# Altium project quang.PrjPcb
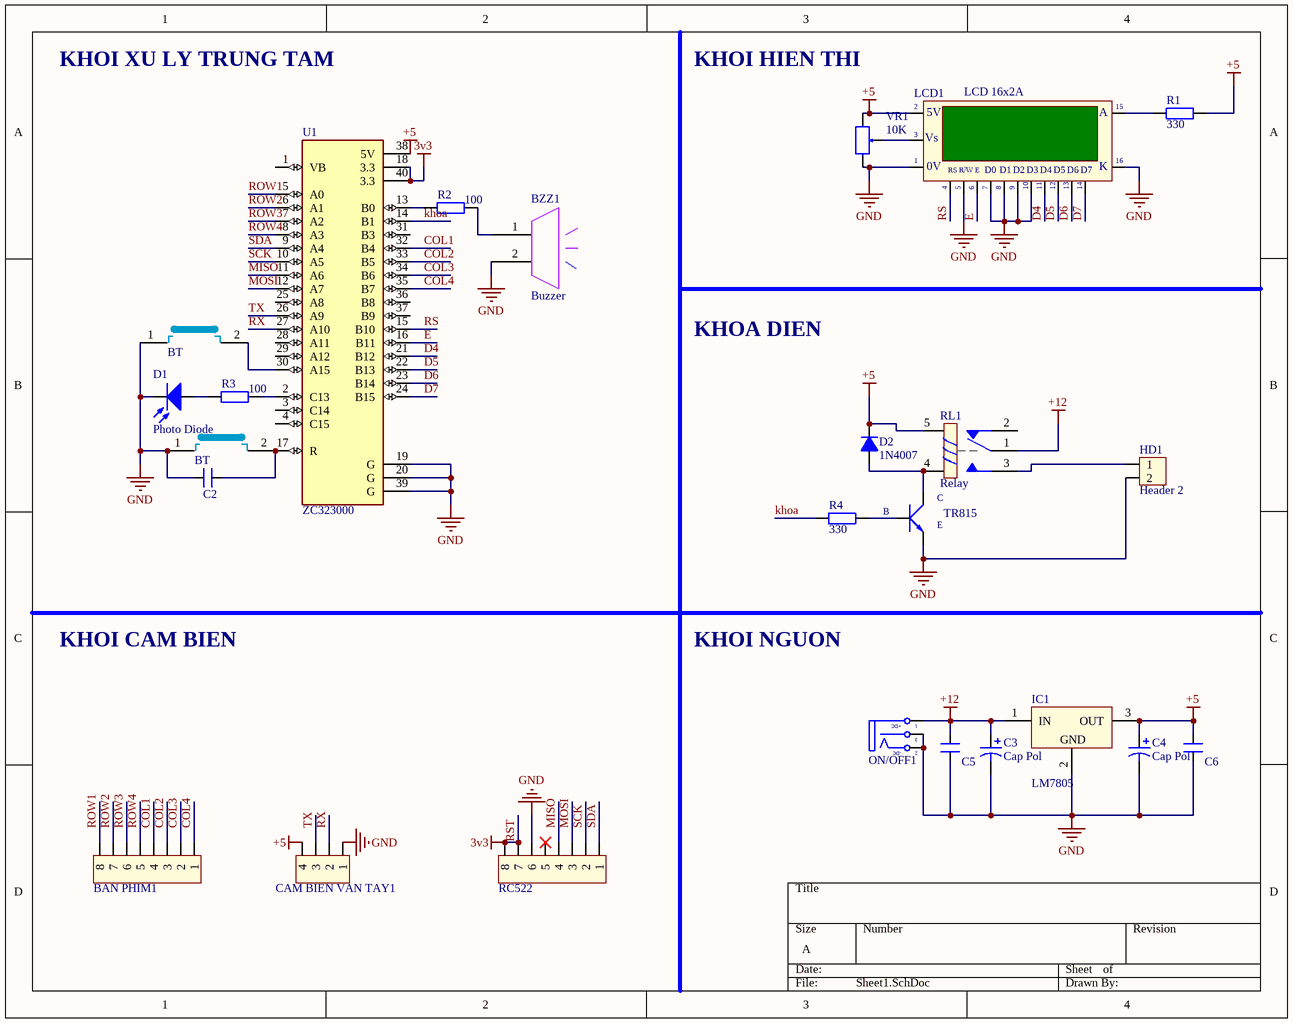
[diagram p0: Sheet1.SchDoc]
1 sheet, 25 parts. Net scope: global (net labels, ports and power ports of the same name join across sheets).
Board file: PCB1.PcbDoc

## Sheet Sheet1.SchDoc
size A; SheetNumber: 1; SheetTotal: 1

### Parts
BAN_PHIM1  JP8  [CON8]  (value not drawn)
BT1  BT  [SW4]
BT2  BT  [SW4]
BZZ1  Buzzer  [buzzer 5V]
C2  CAP gom  [CN1]  (value not drawn)
C3  Cap Pol  [C3MM]
C4  Cap Pol  [C3MM]
C5  CAP gom  [CN1]  (value not drawn)
C6  CAP gom  [CN1]  (value not drawn)
CAM_BIEN_VAN_TAY1  JP4  [CON4]  (value not drawn)
D1  Photo Diode  [LED-5]
D2  1N4007  [D1A]
HD1  Header 2  [HED2]
IC1  LM7805  [QTO-220]
LCD1  LCD 16x2A  [LCD16X2]
ON/OFF1  POWER  [DC-IN]  (value not drawn)
R1  330  [DIEN TRO 1/4 W]
R2  100  [DIEN TRO 1/4 W]
R3  100  [DIEN TRO 1/4 W]
R4  330  [DIEN TRO 1/4 W]
RC522  JP8  [CON8]  (value not drawn)
RL1  Relay  [RL_SPDT_10A]
STA.TR1  TR815  [QTO-92]
U1  ZC323000  [MODULE_ZC323000]
VR1  10K  [VR]

### Nets
+5: C4.1 C6.2 CAM_BIEN_VAN_TAY1.4 D2.2(K) IC1.3(OUT) LCD1.2(VDD) R1.2 RL1.5 U1.38(5V) VR1.1
+12: C3.1 C5.2 IC1.1(IN) ON/OFF1.1(T) RL1.1
GND: BT1.1 BT2.1 BZZ1.2 C2.1 C3.2 C4.2 C5.1 C6.1 CAM_BIEN_VAN_TAY1.1 D1.2(K) HD1.2 IC1.2(GND) LCD1.1(GND) LCD1.5(R/~{W}) LCD1.7(D0) LCD1.8(D1) LCD1.9(D2) LCD1.10(D3) LCD1.16(K) ON/OFF1.2(TN) ON/OFF1.3(S) RC522.6 STA.TR1.1(E) U1.19(G) U1.20(G) U1.39(G) VR1.3
RST: RC522.7 RC522.8 U1.18(3.3) U1.40(3.3)  [also labelled 3v3]
COL1: BAN_PHIM1.4 U1.32(B4)
COL2: BAN_PHIM1.3 U1.33(B5)
COL3: BAN_PHIM1.2 U1.34(B6)
COL4: BAN_PHIM1.1 U1.35(B7)
D4: LCD1.11(D4) U1.21(B12)
D5: LCD1.12(D5) U1.22(B13)
D6: LCD1.13(D6) U1.23(B14)
D7: LCD1.14(D7) U1.24(B15)
E: LCD1.6(~{EN}) U1.16(B11)
khoa: R4.1 U1.14(B1)
MISO: RC522.4 U1.11(A6)
MOSI: RC522.3 U1.12(A7)
ROW1: BAN_PHIM1.8 U1.5(A0)
ROW2: BAN_PHIM1.7 U1.6(A1)
ROW3: BAN_PHIM1.6 U1.7(A2)
ROW4: BAN_PHIM1.5 U1.8(A3)
RS: LCD1.4(RS) U1.15(B10)
RX: CAM_BIEN_VAN_TAY1.2 U1.27(A10)
SCK: RC522.2 U1.10(A5)
SDA: RC522.1 U1.9(A4)
TX: CAM_BIEN_VAN_TAY1.3 U1.26(A9)
NetBT1_2: BT1.2 U1.30(A15)
NetBT2_2: BT2.2 C2.2 U1.17(R)
NetBZZ1_1: BZZ1.1 R2.2
NetD1_1: D1.1(A) R3.1
NetD2_1: D2.1(A) RL1.4 STA.TR1.2(C)
NetHD1_1: HD1.1 RL1.3
NetLCD1_3: LCD1.3(VEE) VR1.2
NetLCD1_15: LCD1.15(A) R1.1
NetR2_1: R2.1 U1.13(B0)
NetR3_2: R3.2 U1.2(C13)
NetR4_2: R4.2 STA.TR1.3(B)

Not connected (* = marked no-connect by the designer): RC522 5*; RL1 2; U1 1(VB) 3(C14) 4(C15) 25(A8) 28(A11) 29(A12) 31(B3) 36(B8) 37(B9)

### Notes on the sheet
- KHOI XU LY TRUNG TAM
- KHOI HIEN THI
- KHOA DIEN
- KHOI CAM BIEN
- KHOI NGUON
- (in symbol DCIN) +DC; -DC
- (in symbol LCD16x2A) 5V; Vs; |; 0V; R/W; E

### Library data of the parts
BAN_PHIM1 RC522 = Con8: Connector 8; Value: Connector 8
BT1 BT2 = BUTTON
C3 C4 = Cap Pol: Polarized Capacitor (Axial); Published: 8-Jun-2000; LatestRevisionDate: 17-Jul-2002; LatestRevisionNote: Re-released for DXP Platform.; PackageReference: POLAR0.8; Publisher: Altium Limited
CAM_BIEN_VAN_TAY1 = Con4: Connector 4; Value: Connector 4
D1 = Photo Diode: Photosensitive Diode
D2 = D1A: Diode 1A; Value: 1N4007
HD1 = Hed2: Header 2 (Green); Value: Header 2
IC1 = LM78xx: On ap +, from + 5 to + 24VDC; Value: LM7805
LCD1 = LCD16x2A: LCD dipslay 16 char, 2 line; Value: LCD16x2A
ON/OFF1 = DCIN
R1-R4 = Res 1/4 W: Resistor; Value: R; Published: 8-Jun-2000; LatestRevisionDate: 17-Jul-2002; LatestRevisionNote: Re-released for DXP Platform.; PackageReference: AXIAL-0.4; Publisher: Altium Limited
RL1 = Relay SRD: Relay SPDT 5 Pin; Value: Relay SPDT, 10A, 12V
STA.TR1 = C1815: NPN 600mW, ECB; Value: C1815
U1 = ZC323000: STM32F103C8T6 ARM STM32 Minimum System Development Board Module For Arduino; MF: YKS; Package: None; Availability: Unavailable; MP: ZC323000; SnapEDA_Link: https://www.snapeda.com/parts/ZC323000/YKS/view-part/725364/?ref=snap; Value: *; Price: None
VR1 = VR: Var Resistor; Value: VR 10K